# Altium schematic sheet 08_Display.SchDoc: Display
size A4; DrawnBy: YILDIRIM_DOGRU
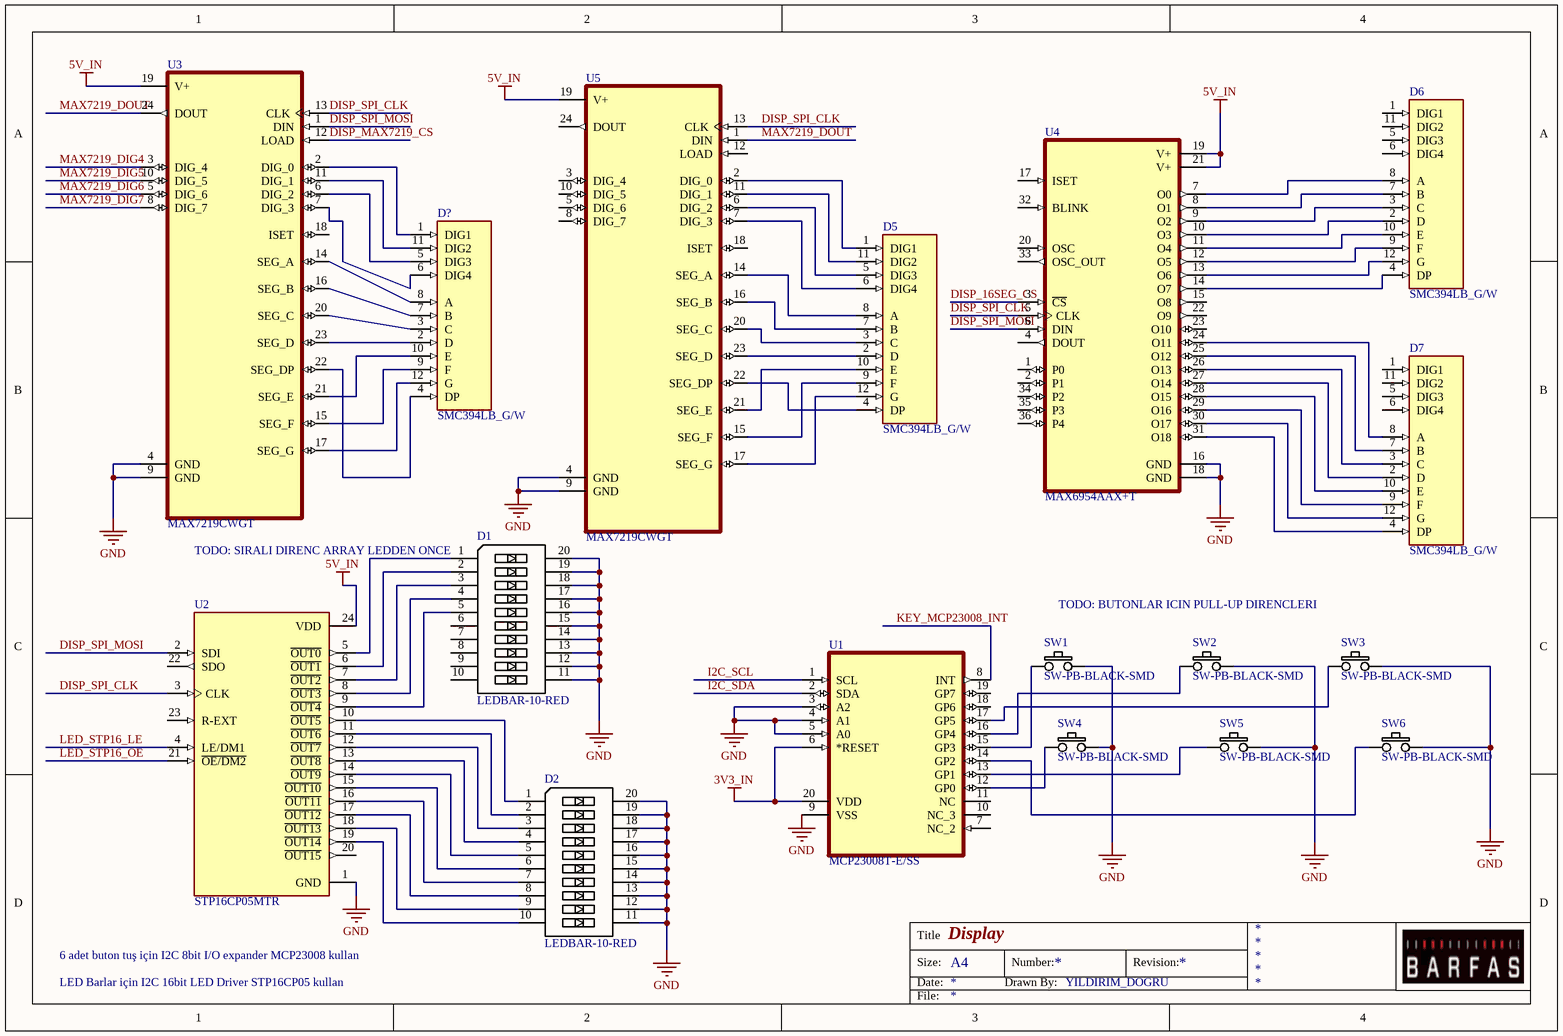
[diagram p0: 08_Display.SchDoc]

## Parts
D1  LEDBAR-10-RED  [LEDBAR-10-RED]
D2  LEDBAR-10-RED  [LEDBAR-10-RED]
D5  SMC394LB_G/W  [LED_SMC394LB_G/W]
D6  SMC394LB_G/W  [LED_SMC394LB_G/W]
D7  SMC394LB_G/W  [LED_SMC394LB_G/W]
D?  SMC394LB_G/W  [LED_SMC394LB_G/W]
SW1  SW-PB-BLACK-SMD  [SW-PB-SMD]
SW2  SW-PB-BLACK-SMD  [SW-PB-SMD]
SW3  SW-PB-BLACK-SMD  [SW-PB-SMD]
SW4  SW-PB-BLACK-SMD  [SW-PB-SMD]
SW5  SW-PB-BLACK-SMD  [SW-PB-SMD]
SW6  SW-PB-BLACK-SMD  [SW-PB-SMD]
U1  MCP23008T-E/SS  [SOP65P780X200-20N]
U2  STP16CP05MTR  [SOIC127P1032X265-24N]
U3  MAX7219CWGT  [SOIC127P1032X265-24N]
U4  MAX6954AAX+T  [SOP80P1033X265-36N]
U5  MAX7219CWGT  [SOIC127P1032X265-24N]

## Nets
3V3_IN: U1.6(*RESET) U1.20(VDD)
5V_IN: U2.24(VDD) U3.19(V+) U4.19(V+) U4.21(V+) U5.19(V+)
GND: D1.11 D1.12 D1.13 D1.14 D1.15 D1.16 D1.17 D1.18 D1.19 D1.20 D2.11 D2.12 D2.13 D2.14 D2.15 D2.16 D2.17 D2.18 D2.19 D2.20 SW1.2 SW2.2 SW3.2 SW4.2 SW5.2 SW6.2 U1.3(A2) U1.4(A1) U1.5(A0) U1.9(VSS) U2.1(GND) U3.4(GND) U3.9(GND) U4.16(GND) U4.18(GND) U5.4(GND) U5.9(GND)
DISP_16SEG_CS: U4.3(~{CS})
DISP_MAX7219_CS: U3.12(LOAD)
DISP_SPI_CLK: U2.3(CLK) U3.13(CLK) U4.5(CLK) U5.13(CLK)
DISP_SPI_MOSI: U2.2(SDI) U3.1(DIN) U4.6(DIN)
I2C_SCL: U1.1(SCL)
I2C_SDA: U1.2(SDA)
KEY_MCP23008_INT: U1.8(INT)
LED_STP16_LE: U2.4(LE/DM1)
LED_STP16_OE: U2.21(~{OE/DM2})
MAX7219_DIG4: U3.3(DIG_4)
MAX7219_DIG5: U3.10(DIG_5)
MAX7219_DIG6: U3.5(DIG_6)
MAX7219_DIG7: U3.8(DIG_7)
MAX7219_DOUT: U3.24(DOUT) U5.1(DIN)
NetD1_1: D1.1 U2.5(~{OUT0})
NetD1_2: D1.2 U2.6(~{OUT1})
NetD1_3: D1.3 U2.7(~{OUT2})
NetD1_4: D1.4 U2.8(~{OUT3})
NetD1_5: D1.5 U2.9(~{OUT4})
NetD2_1: D2.1 U2.10(~{OUT5})
NetD2_2: D2.2 U2.11(~{OUT6})
NetD2_3: D2.3 U2.12(~{OUT7})
NetD2_4: D2.4 U2.13(~{OUT8})
NetD2_5: D2.5 U2.14(~{OUT9})
NetD2_6: D2.6 U2.15(~{OUT10})
NetD2_7: D2.7 U2.16(~{OUT11})
NetD2_8: D2.8 U2.17(~{OUT12})
NetD2_9: D2.9 U2.18(~{OUT13})
NetD2_10: D2.10 U2.19(~{OUT14})
NetD5_1: D5.1(DIG1) U5.2(DIG_0)
NetD5_2: D5.2(D) U5.23(SEG_D)
NetD5_3: D5.3(C) U5.20(SEG_C)
NetD5_4: D5.4(DP) U5.22(SEG_DP)
NetD5_5: D5.5(DIG3) U5.6(DIG_2)
NetD5_6: D5.6(DIG4) U5.7(DIG_3)
NetD5_7: D5.7(B) U5.16(SEG_B)
NetD5_8: D5.8(A) U5.14(SEG_A)
NetD5_9: D5.9(F) U5.15(SEG_F)
NetD5_10: D5.10(E) U5.21(SEG_E)
NetD5_11: D5.11(DIG2) U5.11(DIG_1)
NetD5_12: D5.12(G) U5.17(SEG_G)
NetD6_2: D6.2(D) U4.10(O3)
NetD6_3: D6.3(C) U4.9(O2)
NetD6_4: D6.4(DP) U4.14(O7)
NetD6_7: D6.7(B) U4.8(O1)
NetD6_8: D6.8(A) U4.7(O0)
NetD6_9: D6.9(F) U4.12(O5)
NetD6_10: D6.10(E) U4.11(O4)
NetD6_12: D6.12(G) U4.13(O6)
NetD7_2: D7.2(D) U4.27(O14)
NetD7_3: D7.3(C) U4.26(O13)
NetD7_4: D7.4(DP) U4.31(O18)
NetD7_7: D7.7(B) U4.25(O12)
NetD7_8: D7.8(A) U4.24(O11)
NetD7_9: D7.9(F) U4.29(O16)
NetD7_10: D7.10(E) U4.28(O15)
NetD7_12: D7.12(G) U4.30(O17)
NetD?_1: D?.1(DIG1) U3.2(DIG_0)
NetD?_2: D?.2(D) U3.23(SEG_D)
NetD?_3: D?.3(C) U3.20(SEG_C)
NetD?_4: D?.4(DP) U3.22(SEG_DP)
NetD?_5: D?.5(DIG3) U3.6(DIG_2)
NetD?_6: D?.6(DIG4) U3.7(DIG_3)
NetD?_7: D?.7(B) U3.16(SEG_B)
NetD?_8: D?.8(A) U3.14(SEG_A)
NetD?_9: D?.9(F) U3.15(SEG_F)
NetD?_10: D?.10(E) U3.21(SEG_E)
NetD?_11: D?.11(DIG2) U3.11(DIG_1)
NetD?_12: D?.12(G) U3.17(SEG_G)
NetSW1_1: SW1.1 U1.15(GP3)
NetSW2_1: SW2.1 U1.16(GP4)
NetSW3_1: SW3.1 U1.17(GP5)
NetSW4_1: SW4.1 U1.12(GP0)
NetSW5_1: SW5.1 U1.13(GP1)
NetSW6_1: SW6.1 U1.14(GP2)

Not connected (* = marked no-connect by the designer): D1 6 7 8 9 10; D6 1(DIG1) 5(DIG3) 6(DIG4) 11(DIG2); D7 1(DIG1) 5(DIG3) 6(DIG4) 11(DIG2); U1 7(NC_2) 10(NC_3) 11(NC) 18(GP6) 19(GP7); U2 20(~{OUT15}) 22(SDO) 23(R-EXT); U3 18(ISET); U4 1(P0) 2(P1) 4(DOUT) 15(O8) 17(ISET) 20(OSC) 22(O9) 23(O10) 32(BLINK) 33(OSC_OUT) 34(P2) 35(P3) 36(P4); U5 3(DIG_4) 5(DIG_6) 8(DIG_7) 10(DIG_5) 12(LOAD) 18(ISET) 24(DOUT)

## Notes on the sheet
- TODO: SIRALI DIRENC ARRAY LEDDEN ONCE
- TODO: BUTONLAR ICIN PULL-UP DIRENCLERI
- LED Barlar için I2C 16bit LED Driver STP16CP05 kullan
- 6 adet buton tuş için I2C 8bit I/O expander MCP23008 kullan
- Title
- Size:
- Date:
- A4
- Drawn By:
- Number:
- Revision:
- File:

## Library data of the parts
SW1-SW6 = SW-PB-BLACK-SMD: PUSHBUTTON SWITCH 6MM SMD
U1 = MCP23008T-E/SS: Extenseur d'entrÃ©es/sorties 8 bits, interface I2C 20 SSOP 0,209 po T/R ¦ Microchip Technology Inc. MCP23008T-E/SS; SnapEDA_Link: https://www.snapeda.com/parts/MCP23008T-E/SS/Microchip/view-part/?ref=snap; Package: SSOP-20 Microchip; Value: *; MF: Microchip; MP: MCP23008T-E/SS; Check_prices: https://www.snapeda.com/parts/MCP23008T-E/SS/Microchip/view-part/?ref=eda
U3 U5 = MAX7219CWGT: IC DRVR 7 SEGMNT 8 DIGIT 24SOIC; MF: Analog Devices; MP: MAX7219CWG+; SnapEDA_Link: https://www.snapeda.com/parts/MAX7219CWG+/Analog+Devices/view-part/?ref=snap; Package: SOIC-24 Maxim; Value: *; Check_prices: https://www.snapeda.com/parts/MAX7219CWG+/Analog+Devices/view-part/?ref=eda
U4 = MAX6954AAX+T: MF: {'manufacturer': u'Analog Devices Inc./Maxim Integrated'}; Package: None; Price: None; Value: *; MP: MAX6954AAX+T; Availability: Unavailable
D1 D2 = LEDBAR-10-RED: Supplier 1: Mouser; Supplier Part Number 1: 604-DC10GWA
D5-D7 D? = SMC394LB_G/W: Package: None; Price: None; Value: *; MP: SMC394LB_G/W; Availability: Unavailable
U2 = STP16CP05MTR: Package: None; Price: None; Value: *; MP: STP16CP05MTR; Availability: Unavailable